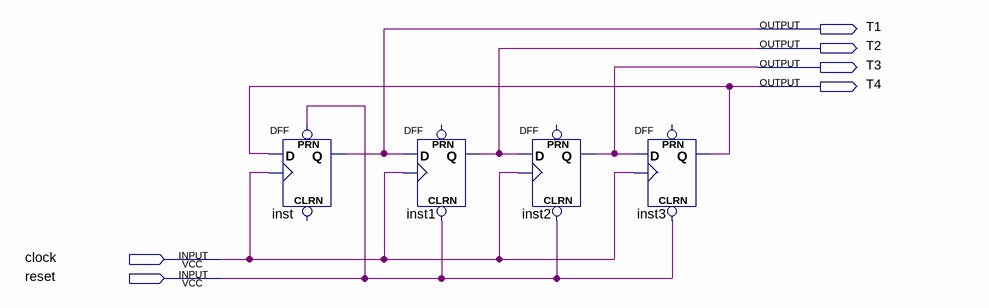
[diagram p0: schematic sheet]
// Quartus schematic Chapter3.bdf as structural Verilog: 4 symbols, 6 pins
module Chapter3 (
  input  clock,
  input  reset,
  output T1,
  output T2,
  output T3,
  output T4
);

  DFF inst (.CLK(clock), .D(T4), .PRN(reset), .Q(T1));  // open: CLRN
  DFF inst1 (.CLRN(reset), .CLK(clock), .D(T1), .Q(T2));  // open: PRN
  DFF inst2 (.CLRN(reset), .CLK(clock), .D(T2), .Q(T3));  // open: PRN
  DFF inst3 (.CLRN(reset), .CLK(clock), .D(T3), .Q(T4));  // open: PRN
endmodule
